# EAGLE design tick-mk-4.6.1 (EAGLE 6.5.0)
VERSION: 4.6.1
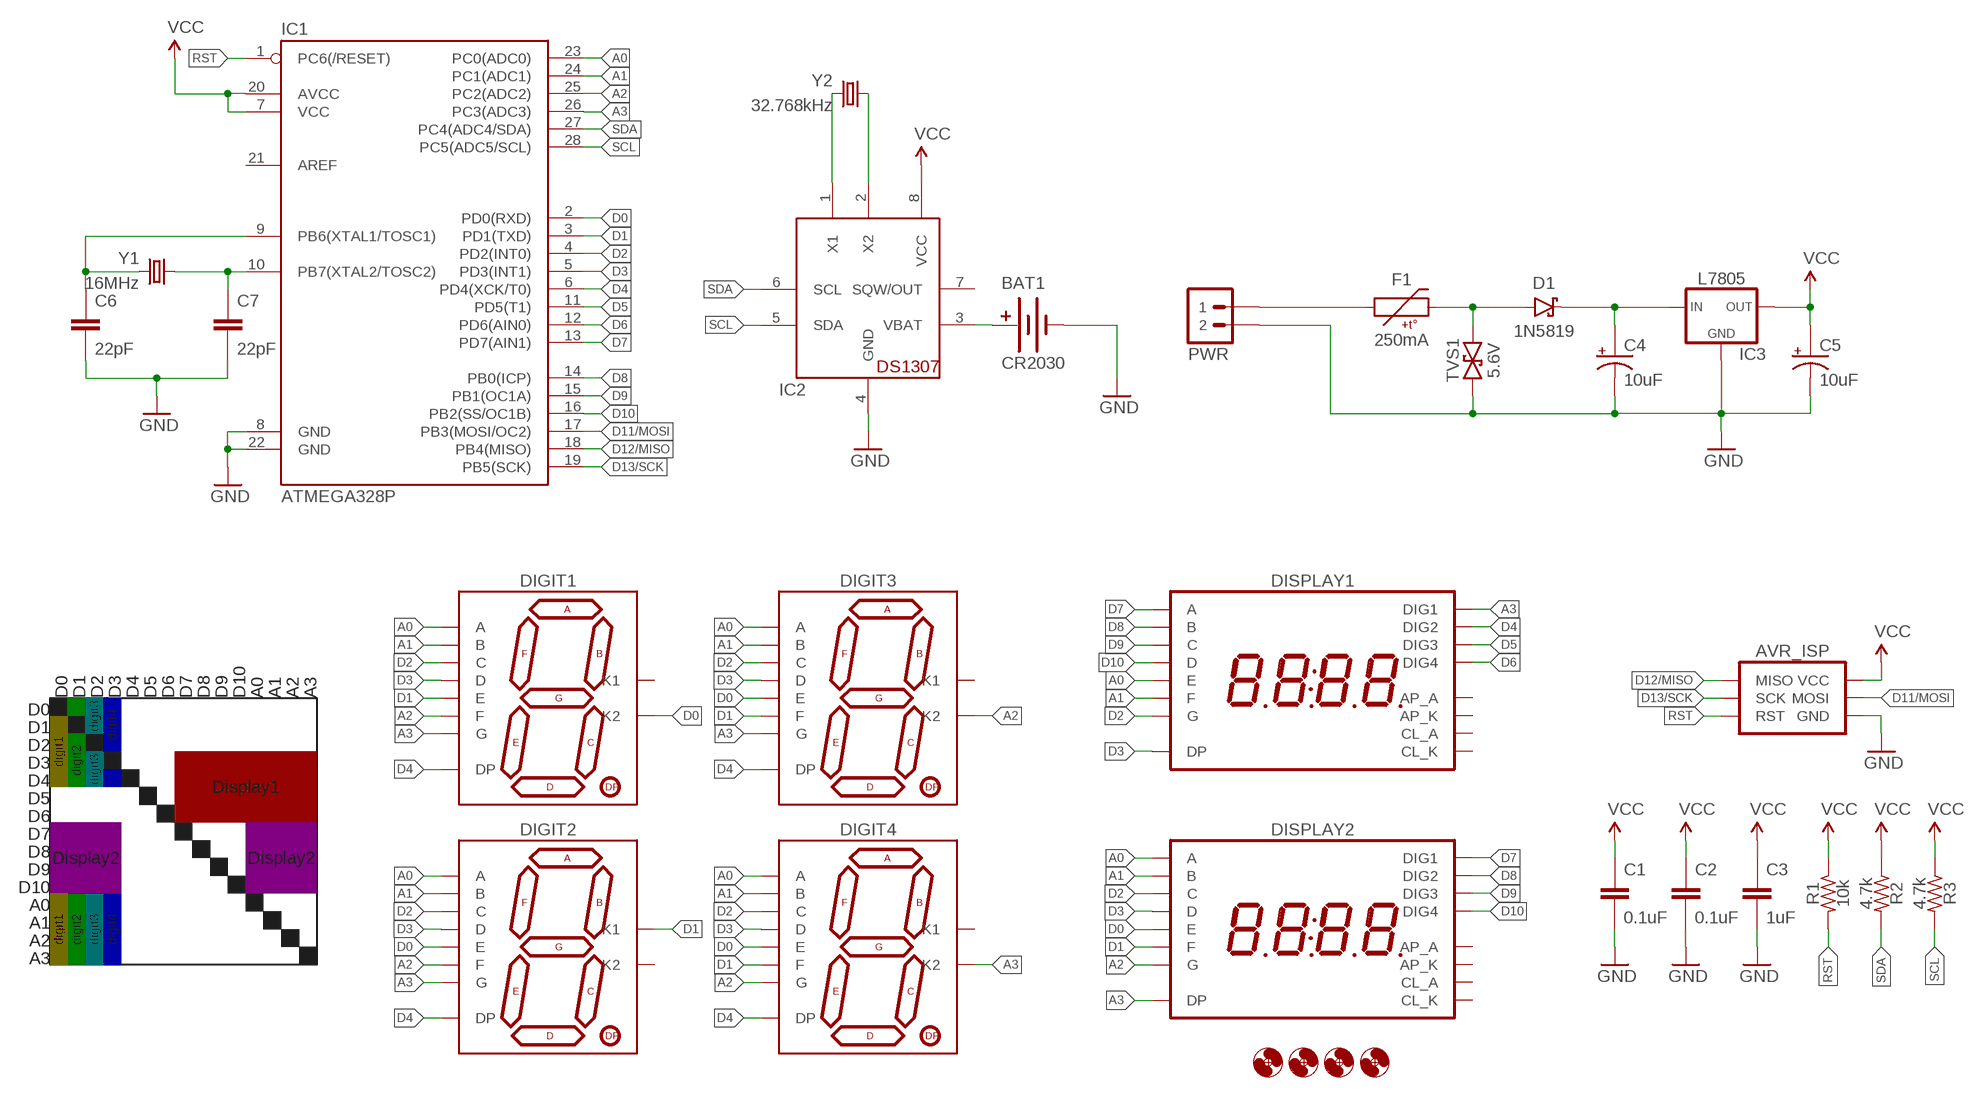
[diagram p0: schematic, sheet 1]

## Parts
AVR_ISP  AVR_SPI_PRG_6PTH  [2X3]
BAT1  CR2030  BATTERY20MMSMD-MINE  [BATTCON_20MM_MINE]
C1  0.1uF  CAPACITOR-CERAMIC025-024X044  [C025-024X044]
C2  0.1uF  CAPACITOR-CERAMIC025-024X044  [C025-024X044]
C3  1uF  CAPACITOR-CERAMIC025-024X044  [C025-024X044]
C4  10uF  CAPACITOR-POLARIZEDE2-5  [E2-5]
C5  10uF  CAPACITOR-POLARIZEDE2-5  [E2-5]
C6  22pF  CAPACITOR-CERAMIC025-024X044  [C025-024X044]
C7  22pF  CAPACITOR-CERAMIC025-024X044  [C025-024X044]
D1  1N5819  DIODE-SCHOTTKYPTH-10.16MM  [DIODE-10.16MM]
DIGIT1  7SEG_1DIGPTH-25.4MM-BARE  [7SEG_1DIG_25.4MM_NOSILK]
DIGIT2  7SEG_1DIGPTH-25.4MM-BARE  [7SEG_1DIG_25.4MM_NOSILK]
DIGIT3  7SEG_1DIGPTH-25.4MM-BARE  [7SEG_1DIG_25.4MM_NOSILK]
DIGIT4  7SEG_1DIGPTH-25.4MM-BARE  [7SEG_1DIG_25.4MM_NOSILK]
DISPLAY1  7SEG_4DIGIT_COLON_APOS  [7SEG_4DIG_10MM]
DISPLAY2  7SEG_4DIGIT_COLON_APOS  [7SEG_4DIG_10MM]
F1  250mA  PTCPTH-5.08MM  [PTC-PTH-5.08MM]
H1  HOLE#2  [HOLE-#2]
H2  HOLE#2  [HOLE-#2]
H3  HOLE#2  [HOLE-#2]
H4  HOLE#2  [HOLE-#2]
IC1  ATMEGA328P  ATMEGA328P_PDIP  [DIL28-3]
IC2  DS1307  [DIL08]
IC3  L7805  V_REG_78XXTO-220-THERMPAD  [TO220-IGO-THERMPAD]
PWR  M02JST-PTH-VERT  [JST-2-PH-VERT-PTH]
R1  10k  RESISTORPTH-AXIAL-7.62MM  [RESISTOR-AXIAL-PTH-7.62MM]
R2  4.7k  RESISTORPTH-AXIAL-6.35MM  [RESISTOR-AXIAL-PTH-6.35MM]
R3  4.7k  RESISTORPTH-AXIAL-6.35MM  [RESISTOR-AXIAL-PTH-6.35MM]
TVS1  5.6V  TVSDO-41-10.16MM  [DO-41-TVS-BI-10.16MM]
Y1  16MHz  CRYSTALHC49UV  [HC49U-V]
Y2  32.768kHz  CRYSTALTC26H  [TC26H]

## Nets
A0: DIGIT1.7(A) DIGIT2.7(A) DIGIT3.7(A) DIGIT4.7(A) DISPLAY1.5(E) DISPLAY2.14(A) IC1.23(PC0(ADC0))
A1: DIGIT1.6(B) DIGIT2.6(B) DIGIT3.6(B) DIGIT4.6(B) DISPLAY1.11(F) DISPLAY2.16(B) IC1.24(PC1(ADC1))
A2: DIGIT1.9(F) DIGIT2.9(F) DIGIT3.8(K2) DIGIT4.10(G) DISPLAY2.15(G) IC1.25(PC2(ADC2))
A3: DIGIT1.10(G) DIGIT2.10(G) DIGIT3.10(G) DIGIT4.8(K2) DISPLAY1.1(DIG1) DISPLAY2.7(DP) IC1.26(PC3(ADC3))
D0: DIGIT1.8(K2) DIGIT2.1(E) DIGIT3.1(E) DIGIT4.1(E) DISPLAY2.5(E) IC1.2(PD0(RXD))
D1: DIGIT1.1(E) DIGIT2.3(K1) DIGIT3.9(F) DIGIT4.9(F) DISPLAY2.11(F) IC1.3(PD1(TXD))
D2: DIGIT1.4(C) DIGIT2.4(C) DIGIT3.4(C) DIGIT4.4(C) DISPLAY1.15(G) DISPLAY2.13(C) IC1.4(PD2(INT0))
D3: DIGIT1.2(D) DIGIT2.2(D) DIGIT3.2(D) DIGIT4.2(D) DISPLAY1.7(DP) DISPLAY2.3(D) IC1.5(PD3(INT1))
D4: DIGIT1.5(DP) DIGIT2.5(DP) DIGIT3.5(DP) DIGIT4.5(DP) DISPLAY1.2(DIG2) IC1.6(PD4(XCK/T0))
D5: DISPLAY1.6(DIG3) IC1.11(PD5(T1))
D6: DISPLAY1.8(DIG4) IC1.12(PD6(AIN0))
D7: DISPLAY1.14(A) DISPLAY2.1(DIG1) IC1.13(PD7(AIN1))
D8: DISPLAY1.16(B) DISPLAY2.2(DIG2) IC1.14(PB0(ICP))
D9: DISPLAY1.13(C) DISPLAY2.6(DIG3) IC1.15(PB1(OC1A))
D10: DISPLAY1.3(D) DISPLAY2.8(DIG4) IC1.16(PB2(SS/OC1B))
D11/MOSI: AVR_ISP.4(MOSI) IC1.17(PB3(MOSI/OC2))
D12/MISO: AVR_ISP.1(MISO) IC1.18(PB4(MISO))
D13/SCK: AVR_ISP.3(SCK) IC1.19(PB5(SCK))
GND: AVR_ISP.6(GND) BAT1.BOTTOM(-) C1.2 C2.2 C3.2 C4.- C5.- C6.2 C7.2 IC1.8(GND) IC1.22(GND) IC2.4(GND) IC3.4(GND) IC3.GND PWR.2 TVS1.P$1
N$1: BAT1.TOP@1(+) BAT1.TOP@2(+) IC2.3(VBAT)
N$2: IC2.1(X1) Y2.2
N$3: IC2.2(X2) Y2.1
N$4: D1.A F1.P$2 TVS1.P$2
N$6: C6.1 IC1.9(PB6(XTAL1/TOSC1)) Y1.2
N$7: F1.P$1 PWR.1
N$8: C4.+ D1.C IC3.IN
N$9: C7.1 IC1.10(PB7(XTAL2/TOSC2)) Y1.1
RST: AVR_ISP.5(RST) IC1.1(PC6(/RESET)) R1.P$2
SCL: IC1.28(PC5(ADC5/SCL)) IC2.5(SDA) R3.P$2
SDA: IC1.27(PC4(ADC4/SDA)) IC2.6(SCL) R2.P$2
VCC: AVR_ISP.2(VCC) C1.1 C2.1 C3.1 C5.+ IC1.7(VCC) IC1.20(AVCC) IC2.8(VCC) IC3.OUT R1.P$1 R2.P$1 R3.P$1
Unconnected: DIGIT1.3(K1) DIGIT2.8(K2) DIGIT3.3(K1) DIGIT4.3(K1) DISPLAY1.4(CL_A) DISPLAY1.9(AP_K) DISPLAY1.10(AP_A) DISPLAY1.12(CL_K) DISPLAY2.4(CL_A) DISPLAY2.9(AP_K) DISPLAY2.10(AP_A) DISPLAY2.12(CL_K) IC1.21(AREF) IC2.7(SQW/OUT)

## Notes on the sheet
- D0 | D1 | D2 | D3 | D4 | D5 | D6 | D7 | D8 | D9 | D10 | A0 | A1 | A2 | A3
- D0 | digit3
- digit4
- D1
- D2 | digit1
- digit2
- D3 | digit3
- D4 | Display1
- D5
- D6
- D7
- D8 | Display2 | Display2
- D9
- D10
- A0
- A1 | digit1 | digit2 | digit3 | digit4
- A2
- A3

## Library data of the parts
AVR_ISP = A_butts:AVR_SPI_PRG_6: AVR ISP 6 Pin This is the reduced ISP connector for AVR programming. Common on Arduino. This footprint will take up less PCB space and can be used with a 10-pin to 6-pin adapter such as SKU: BOB-08508 **Special note about "TEST_POINT" package. The stop mask is on the top side, so if you want your programming test points to be on the bottom of your board, make sure to place this package on the bottom side of the board. This also ensure that the orientation to program from the bottom side will be correct.
BAT1 = A_butts:BATTERY: Battery Holders Various common sizes : AA, AAA, 20mm coin cell and 12mm coin cell. 20MM_4LEGS, BATT-10373
C1-C3 C6 C7 = A_butts:CAPACITOR-CERAMIC: CAPACITOR, European symbol
C4 C5 = A_butts:CAPACITOR-POLARIZED: POLARIZED CAPACITOR, American symbol
D1 = A_butts:DIODE-SCHOTTKY: Schottky diodes in SFE's production catalog BAT20J 1A 23V 0.62Vf RB751 120mA 40V 0.37Vf PMEG4005EJ 0.5A 40V 0.42Vf MBRA140 1A 40V 0.5Vf B340A 3A 40V SMA
DIGIT1-DIGIT4 = A_butts:7SEG_1DIG
DISPLAY1 DISPLAY2 = A_butts:7SEG_4DIGIT_COLON_APOS
F1 = A_butts:PTC: Resettable Fuse PTC Resettable Fuse. Spark Fun Electronics SKU : COM-08357
H1-H4 = A_butts:HOLE: MOUNTING HOLE with drill center marker
IC1 = A_butts:ATMEGA328P_PDIP: uC used in the Arduino 32kb flash, 1k EEPROM, 2k SRAM This is the through-hole version of this chip.
IC2 = A_butts:DS1307: DS1307 Real time clock (RTC) with battery backup ability. Talk to it via i2c
IC3 = A_butts:V_REG_78XX: Voltage Regulator Standard 7805 5V regulator. IGO (Input Ground Output). Spark Fun Electronics SKU : COM-00107
PWR = A_butts:M02: Standard 2-pin 0.1" header. Use with - straight break away headers ( PRT-00116) - right angle break away headers (PRT-00553) - swiss pins (PRT-00743) - machine pins (PRT-00117) - female headers (PRT-00115) Molex polarized connector foot print use with: PRT-08233 with associated crimp pins and housings. 2.54_SCREWTERM for use with PRT-10571. 3.5mm Screw Terminal footprints for PRT-08084 5mm Screw Terminal footprints for use with PRT-08433
R1-R3 = A_butts:RESISTOR: RESISTOR, American symbol
TVS1 = A_butts:TVS: Transient voltage suppressor- prevents ESD on inputs. Ignore package description- MBRA140 is NOT this type of part!!!
Y1 Y2 = A_butts:CRYSTAL: Various standard crystals. Proven footprints. Spark Fun Electronics SKU : COM-00534

## Board
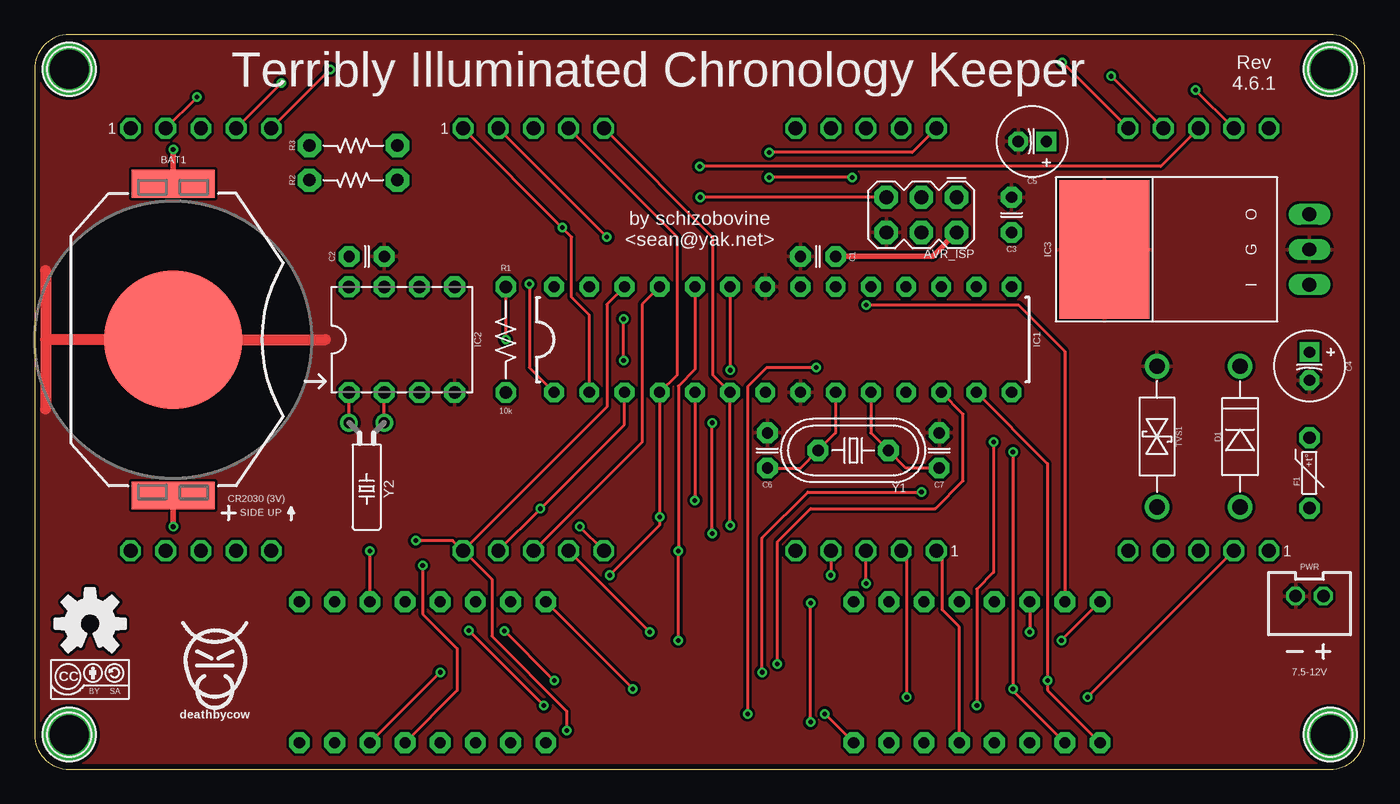
[diagram p1: board, top side]
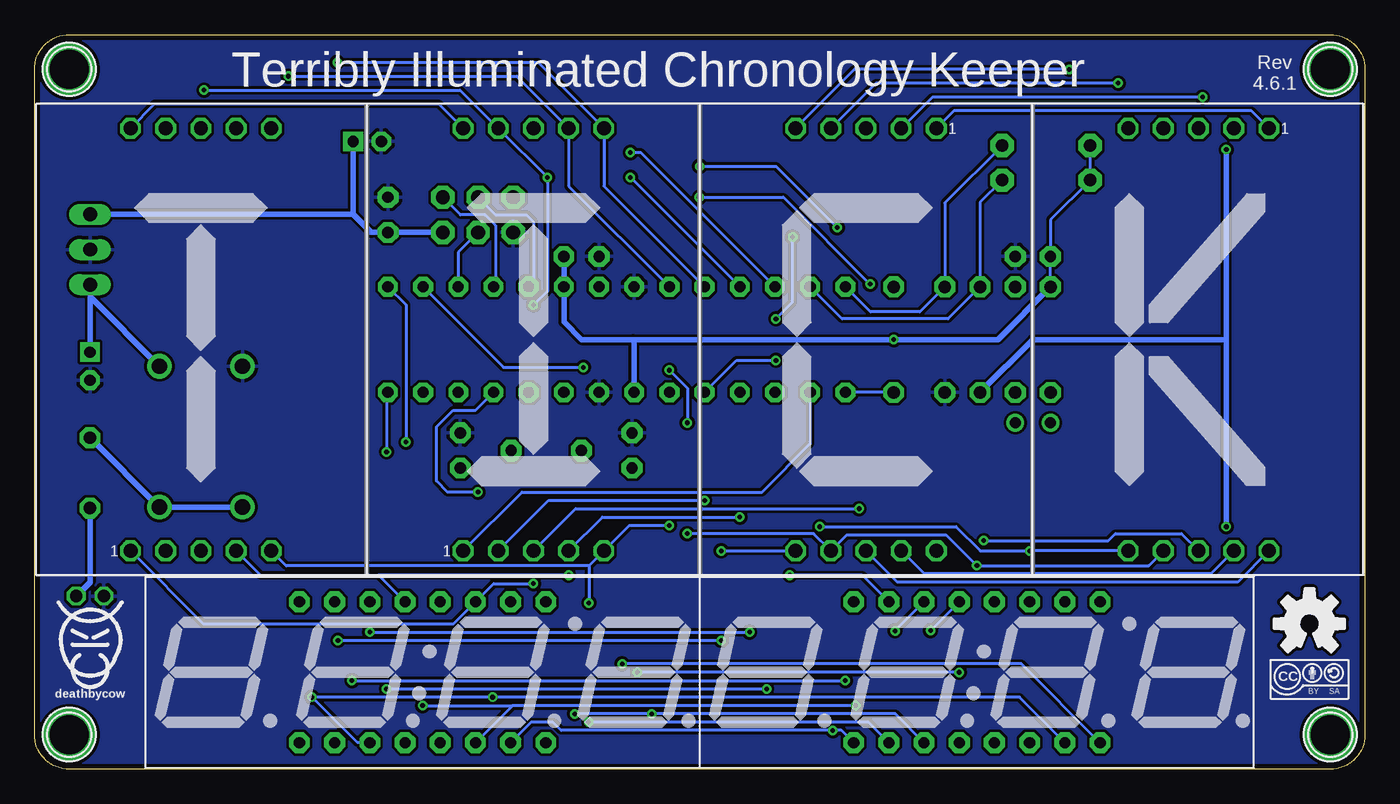
[diagram p2: board, bottom side, seen from below]

Size 96 x 53 mm. Coordinates in mm from the lower left corner, seen from the top.
Outline: 0,50.5 0,2.5 arc90 2.5,0 93.5,0 arc90 96,2.5 96,50.5 arc90 93.5,53 2.5,53 arc90 0,50.5
Copper layers (1*16): Top 0.0356mm / dielectric 1.5011mm / Bottom 0.0356mm
Design rules "LaenPCBOrder_2": minimum track width 6mil, minimum drill 13mil, track to track 6mil, track to pad 6mil, pad to pad 6mil, via to via 6mil, smd to smd 6mil, copper to edge 15mil, drill to drill 6mil, minimum pad ring 7mil, minimum via ring 7mil, stop-mask expansion 3mil, vias tented up to drill 20mil, thermal gap 10mil

### Footprints (pad centres in the part's own frame; a part is rotated, then mirrored left to right if it is on the bottom)
2X3 = drill 1 pad 1.676 octagon: 1 -2.54,-1.27; 2 -2.54,1.27; 3 0,-1.27; 4 0,1.27; 5 2.54,-1.27; 6 2.54,1.27
BATTCON_20MM_MINE = smd 10 x 10: BOTTOM 0,0 | smd 6 x 2: TOP@1 0,11.25; TOP@2 0,-11.25
C025-024X044 = drill 0.813 pad 1.5 octagon: 1 -1.27,0; 2 1.27,0
E2-5 = drill 0.813 pad 1.422 square: + -1.016,0 | drill 0.813 pad 1.422 octagon: - 1.016,0
DIODE-10.16MM = drill 1.1 pad 1.778: A -5.08,0; C 5.08,0
7SEG_1DIG_25.4MM_NOSILK = drill 1 pad 1.5 octagon: 1 -5.08,-15.24; 2 -2.54,-15.24; 3 0,-15.24; 4 2.54,-15.24; 5 5.08,-15.24; 6 5.08,15.24; 7 2.54,15.24; 8 0,15.24; 9 -2.54,15.24; 10 -5.08,15.24
7SEG_4DIG_10MM = drill 0.8 pad 1.5 octagon: 1 -8.89,-5.08; 2 -6.35,-5.08; 3 -3.81,-5.08; 4 -1.27,-5.08; 5 1.27,-5.08; 6 3.81,-5.08; 7 6.35,-5.08; 8 8.89,-5.08; 9 8.89,5.08; 10 6.35,5.08; 11 3.81,5.08; 12 1.27,5.08; 13 -1.27,5.08; 14 -3.81,5.08; 15 -6.35,5.08; 16 -8.89,5.08
PTC-PTH-5.08MM = drill 0.9 pad 1.5 octagon: P$1 -2.54,0; P$2 2.54,0
HOLE-#2 = drill 2.8 pad 3.81: P$1 0,0
DIL28-3 = drill 0.8 pad 1.422 octagon: 1 -16.51,-3.81; 2 -13.97,-3.81; 3 -11.43,-3.81; 4 -8.89,-3.81; 5 -6.35,-3.81; 6 -3.81,-3.81; 7 -1.27,-3.81; 8 1.27,-3.81; 9 3.81,-3.81; 10 6.35,-3.81; 11 8.89,-3.81; 12 11.43,-3.81; 13 13.97,-3.81; 14 16.51,-3.81; 15 16.51,3.81; 16 13.97,3.81; 17 11.43,3.81; 18 8.89,3.81; 19 6.35,3.81; 20 3.81,3.81; 21 1.27,3.81; 22 -1.27,3.81; 23 -3.81,3.81; 24 -6.35,3.81; 25 -8.89,3.81; 26 -11.43,3.81; 27 -13.97,3.81; 28 -16.51,3.81
DIL08 = drill 0.9 pad 1.5 octagon: 1 -3.81,-3.81; 2 -1.27,-3.81; 3 1.27,-3.81; 4 3.81,-3.81; 5 3.81,3.81; 6 1.27,3.81; 7 -1.27,3.81; 8 -3.81,3.81
TO220-IGO-THERMPAD = smd 10 x 6.5: 4 0,11 | drill 1 long: GND 0,-3.81; IN -2.54,-3.81; OUT 2.54,-3.81
JST-2-PH-VERT-PTH = drill 0.9 octagon: 1 -1,0; 2 1,0
RESISTOR-AXIAL-PTH-7.62MM = drill 0.9 pad 1.5 octagon: P$1 -3.81,0; P$2 3.81,0
RESISTOR-AXIAL-PTH-6.35MM = drill 0.9 pad 1.676 octagon: P$1 -3.175,0; P$2 3.175,0
DO-41-TVS-BI-10.16MM = drill 1.1 pad 1.778: P$1 -5.08,0; P$2 5.08,0
HC49U-V = drill 0.813 pad 1.524 octagon: 1 -2.54,0; 2 2.54,0
TC26H = drill 0.8 pad 1.27: 1 -1.27,0; 2 1.27,0

### Placement (x,y rotation side)
AVR_ISP  64,40 180 top
BAT1  10,31 0 top
C1  56.54,37 180 top
C2  23.96,37 0 top
C3  70.5,40 90 top
C4  92,29.08 270 top
C5  72,45.3 180 top
C6  52.88,23 90 top
C7  65.28,23 90 top
D1  87,24 90 top
DIGIT1  84,31 0 bottom
DIGIT2  60,31 0 bottom
DIGIT3  36,31 180 bottom
DIGIT4  12,31 180 bottom
DISPLAY1  28,7 0 bottom
DISPLAY2  68,7 0 bottom
F1  92,21.38 90 top
H1  2.5,2.5 0 top
H2  93.5,2.5 0 top
H3  93.5,50.5 0 top
H4  2.5,50.5 0 top
IC1  54,31 0 top
IC2  26.5,31 0 top
IC3  88.19,37.5 90 top
PWR  92,12.5 180 top
R1  34,31 270 top
R2  23,42.5 0 top
R3  23,45 0 top
TVS1  81,24 270 top
U$1  [TICK_SYMBOL]  48,31 0 bottom
U$2  [COW_SMALL]  13,8 0 top
U$3  [COW_SMALL]  92,9.5 0 bottom
U$4  [CC-BY-SA-4.0-NO-URL]  4,6.5 0 top
U$5  [OSHWLOGO_TOP_0.2]  4,10.5 0 top
U$6  [OSHWLOGO_TOP_0.2]  4,10.5 0 bottom
U$7  [CC-BY-SA-4.0-NO-URL]  4,6.5 0 bottom
Y1  59.08,23 180 top
Y2  23.96,25 180 top

### Tracks (layer width: path | path; a pad name or v marks a point on that pad's centre or on a via)
A0  (via drill 0.33)
  Top 0.2: DIGIT1.7 v77.7,50 | IC1.23 v50.19,28.79 | DISPLAY1.5 30.5,5.69 30.5,8.7 28,11.2 v28,14.7 | DISPLAY2.14 v71.81,9.9 | v44.4,9.9 DIGIT3.7 | v48.9,17 v48.9,25
  Bottom 0.2: v77.7,50 61.22,50 DIGIT2.7 57.46,42.08 IC1.23 | DIGIT4.7 15.6,14.7 v28,14.7 30.2,16.9 37.4,16.9 DIGIT3.7 39.78,17 v48.9,17 | v50.19,28.79 48.9,27.5 v48.9,25 | v71.81,9.9 v44.4,9.9
A1  (via drill 0.33)
  Top 0.2: DIGIT1.6 v74.16,51 | v24.19,15.76 DISPLAY1.11 | DIGIT3.6 v39.34,17.5 | IC1.24 47.65,28.85 46.45,27.65 v46.45,15.76 v46.45,9.3 | DISPLAY2.16 v74.1,9.3
  Bottom 0.2: v74.16,51 59.68,51 DIGIT2.6 54.92,42.08 IC1.24 | DIGIT4.6 v24.19,15.76 27.76,15.76 29.5,17.5 v39.34,17.5 | v46.45,15.76 DIGIT3.6 | v74.1,9.3 v46.45,9.3
A2  (via drill 0.33)
  Top 0.2: DIGIT1.9 v83.78,49 | v59,42.7 v53,42.7 | IC1.25 43.84,33.54 43.84,23.6 DIGIT3.8 | v60,33.5 71,33.5 74.35,30.15 DISPLAY2.15
  Bottom 0.2: v83.78,49 65.3,49 DIGIT2.9 v59,42.7 59,34.5 v60,33.5 | DIGIT4.10 9.18,13.5 33.74,13.5 DIGIT3.8 | v53,42.7 IC1.25
A3  (via drill 0.33)
  Top 0.2: DIGIT3.10 30.18,16.5 v27.5,16.5 | DIGIT2.10 63.34,44.5 v53,44.5 | IC1.26 41.3,33.54 41.3,26.14 DIGIT3.10 | DIGIT3.10 30.94,15.76 33,13.7 33,9.6 38.4,4.2 v38.4,2.8
  Bottom 0.2: DIGIT1.10 87.32,48 66.84,48 DIGIT2.10 | DISPLAY1.1 37.77,2.8 v38.4,2.8 58,2.8 58.6,3.4 60.17,3.4 DISPLAY2.7 | v27.5,16.5 18.5,16.5 18,17 13.24,17 DIGIT4.8 | v53,44.5 52.26,44.5 IC1.26
D0  (via drill 0.33)
  Top 0.2: IC1.2 40.03,32.77 38.76,34.04 38.76,38.4 v38.08,39.08 DIGIT3.1 | DIGIT1.8 81.26,43.5 v48,43.5 | DISPLAY2.5 66.73,10.27 65.5,11.5 65.5,15.34 DIGIT2.1
  Bottom 0.2: DIGIT4.1 8.18,47.5 29.66,47.5 DIGIT3.1 | v48,43.5 42.5,43.5 v38.08,39.08 | DIGIT2.1 60.84,20 43.5,20 40.03,23.47 IC1.2
D1  (via drill 0.33)
  Top 0.2: DIGIT3.9 v36.5,18.8 42.57,24.87 IC1.3 | v60,13.4 DIGIT2.3
  Bottom 0.2: DIGIT4.9 11.12,14.1 31.8,14.1 DIGIT3.9 | DIGIT1.1 83.82,10.5 65.77,10.5 DISPLAY2.11 62.87,13.4 v60,13.4 | DIGIT2.3 56.96,18.8 v36.5,18.8
D2  (via drill 0.33)
  Top 0.2: DIGIT4.4 v17.8,49.5 | DIGIT2.4 v57.46,14 | DIGIT3.4 46.38,38.4 46.38,28.46 IC1.4 v45.11,18.2 45.11,17.61 v41.5,14
  Bottom 0.2: v17.8,49.5 35.28,49.5 DIGIT3.4 | DIGIT1.4 79.7,14 71.19,14 | 71.19,14 DISPLAY2.13 | v57.46,14 71.19,14 | DISPLAY1.15 36.27,14 v41.5,14 | DIGIT2.4 55.02,18.2 v45.11,18.2
D3  (via drill 0.33)
  Top 0.2: DIGIT4.2 v11.72,48.5 | v42.5,29.5 v42.5,32.5 | v41.3,38.4 DIGIT3.2 | IC1.5 v47.65,19.4 | v62.95,5.2 62.95,15.35 DIGIT2.2 | v75.98,5.2 DIGIT1.2
  Bottom 0.2: v11.72,48.5 31.2,48.5 DIGIT3.2 | DISPLAY1.7 24.93,5.2 v62.95,5.2 v75.98,5.2 72.7,1.92 DISPLAY2.3 | IC1.5 45.34,29.5 v42.5,29.5 | v42.5,32.5 41.3,33.7 v41.3,38.4 | DIGIT2.2 58.9,19.4 v47.65,19.4
D4  (via drill 0.33)
  Top 0.2: DIGIT4.5 v21.34,50.5 | v56,3.4 v56,12 | DIGIT3.5 48.92,38.4 48.92,28.46 IC1.6 v50.19,17.6
  Bottom 0.2: v21.34,50.5 36.82,50.5 DIGIT3.5 | DISPLAY1.2 35.83,3.4 v56,3.4 | 56,14.68 DIGIT2.5 53.08,17.6 v50.19,17.6 | 56,14.68 v56,12 | 56,14.68 77.84,14.68 DIGIT1.5
D5  (via drill 0.33)
  Top 0.2: v29.27,7 DISPLAY1.6 | v52.5,7 52.5,16.7 55.8,20 v64,20
  Bottom 0.2: v29.27,7 v52.5,7 | v64,20 66.2,20 67,20.8 67,24.7 65.8,25.9 64.18,25.9 IC1.11
D6  (via drill 0.33)
  Top 0.2: v53.6,7.6 53.6,16.4 56,18.8 65,18.8 67,20.8 67,25.62 IC1.12
  Bottom 0.2: DISPLAY1.8 24.79,7.6 v53.6,7.6
D7  (via drill 0.33)
  Top 0.2: IC1.13 73.1,22.06 v73.1,6.4 73.1,5.71 DISPLAY2.1 | v37.49,6.4 v33.9,9.99
  Bottom 0.2: v73.1,6.4 v37.49,6.4 | v33.9,9.99 DISPLAY1.14
D8  (via drill 0.33)
  Top 0.2: DISPLAY1.16 v43.17,5.8 | v70.6,22.9 v70.6,5.8 70.6,5.67 DISPLAY2.2
  Bottom 0.2: v70.6,5.8 v43.17,5.8 | IC1.14 70.6,27.1 v70.6,22.9
D9  (via drill 0.33)
  Top 0.2: v69.2,23.6 69.2,14.2 68,13 v68,4.6 | v31.35,10 v36.75,4.6
  Bottom 0.2: DISPLAY2.6 61.51,4.6 | v36.75,4.6 61.51,4.6 | IC1.15 69.2,33.5 v69.2,23.6 | DISPLAY1.13 v31.35,10 | v68,4.6 61.51,4.6
D10  (via drill 0.33)
  Top 0.2: v57.03,4 DISPLAY2.8 | v51.45,4 51.45,27.6 52.85,29 v56.4,29
  Bottom 0.2: DISPLAY1.3 33.89,4 v51.45,4 v57.03,4 | IC1.16 62.16,29 v56.4,29
D11/MOSI
  Bottom 0.2: AVR_ISP.4 65.43,37.3 IC1.17
D12/MISO
  Bottom 0.2: AVR_ISP.1 65.27,40 63.5,40 62.74,39.24 62.74,34.96 IC1.18
D13/SCK
  Bottom 0.2: AVR_ISP.3 62.73,40 60.5,40 60,39.5 60,35.16 IC1.19
GND
  Top 0.8: 21,31 BAT1.BOTTOM 0.8,31 | 0.8,36 0.8,31 | 0.8,31 0.8,26
  pour Top (isolate 0.2): 93.5,0 2.5,0 arc-90 0,2.5 0,50.5 arc-90 2.5,53 93.5,53 arc-90 96,50.5 96,2.5 arc-90
  pour Bottom (isolate 0.2): 2.5,53 93.5,53 arc-90 96,50.5 96,2.5 arc-90 93.5,0 2.5,0 arc-90 0,2.5 0,50.5 arc-90
N$1  (via drill 0.33)
  Top 0.4: BAT1.TOP@2 v10,17.5 | v10,44.7 BAT1.TOP@1
  Bottom 0.4: v10,17.5 10,31 | 10,31 v10,44.7 | IC2.3 23.96,31 10,31
N$2
  Top 0.2: Y2.2 IC2.1
N$3
  Top 0.2: Y2.1 IC2.2
N$4
  Bottom 0.4: TVS1.P$2 D1.A F1.P$2
N$5
  cutout Top: 10,21 arc-90 0,31 arc-90 10,41 arc-90 20,31 arc-90
N$6
  Top 0.2: C6.1 55.27,21.73 Y1.2 57.81,24.27 IC1.9
N$7
  Bottom 0.4: F1.P$1 92,13.5 PWR.1
N$8
  Bottom 0.4: C4.+ IC3.IN 92,34.08 D1.C
N$9
  Top 0.2: C7.1 62.89,21.73 Y1.1 60.35,24.27 IC1.10
RST  (via drill 0.33)
  Top 0.2: AVR_ISP.5 v48.03,41.27 | v35.7,35 35.7,28.98 IC1.1
  Bottom 0.2: v48.03,41.27 41.97,41.27 v35.7,35 | R1.P$2 IC1.1
SCL
  Bottom 0.2: R3.P$2 30.31,40.87 IC2.5 32.12,33 35.68,33 IC1.28
SDA
  Bottom 0.2: R2.P$2 27.77,40.91 IC2.6 30.08,32.5 37.72,32.5 IC1.27
VCC  (via drill 0.33)
  Top 0.2: R1.P$1 v34,31
  Top 0.4: AVR_ISP.2 64.81,37 C1.1
  Bottom 0.2: R3.P$1 R2.P$1 22.69,39.63 C2.1 IC2.8
  Bottom 0.4: AVR_ISP.2 C3.1 71.71,38.73 73.02,40.04 | 73.02,40.04 IC3.OUT | IC2.8 26.5,31 v34,31 52.8,31 | 52.8,31 56.54,31 57.81,32.27 IC1.20 C1.1 | C5.+ 73.02,40.04 | IC1.7 52.73,30.93 52.8,31

### Text on the board
tPlace: Rev | Terribly Illuminated Chronology Keeper | by schizobovine / <sean@yak.net> | CR2030 (3V) | SIDE UP | 7.5-12V
bPlace: Rev | Terribly Illuminated Chronology Keeper